# EAGLE schematic Board (EAGLE 8.0.2)
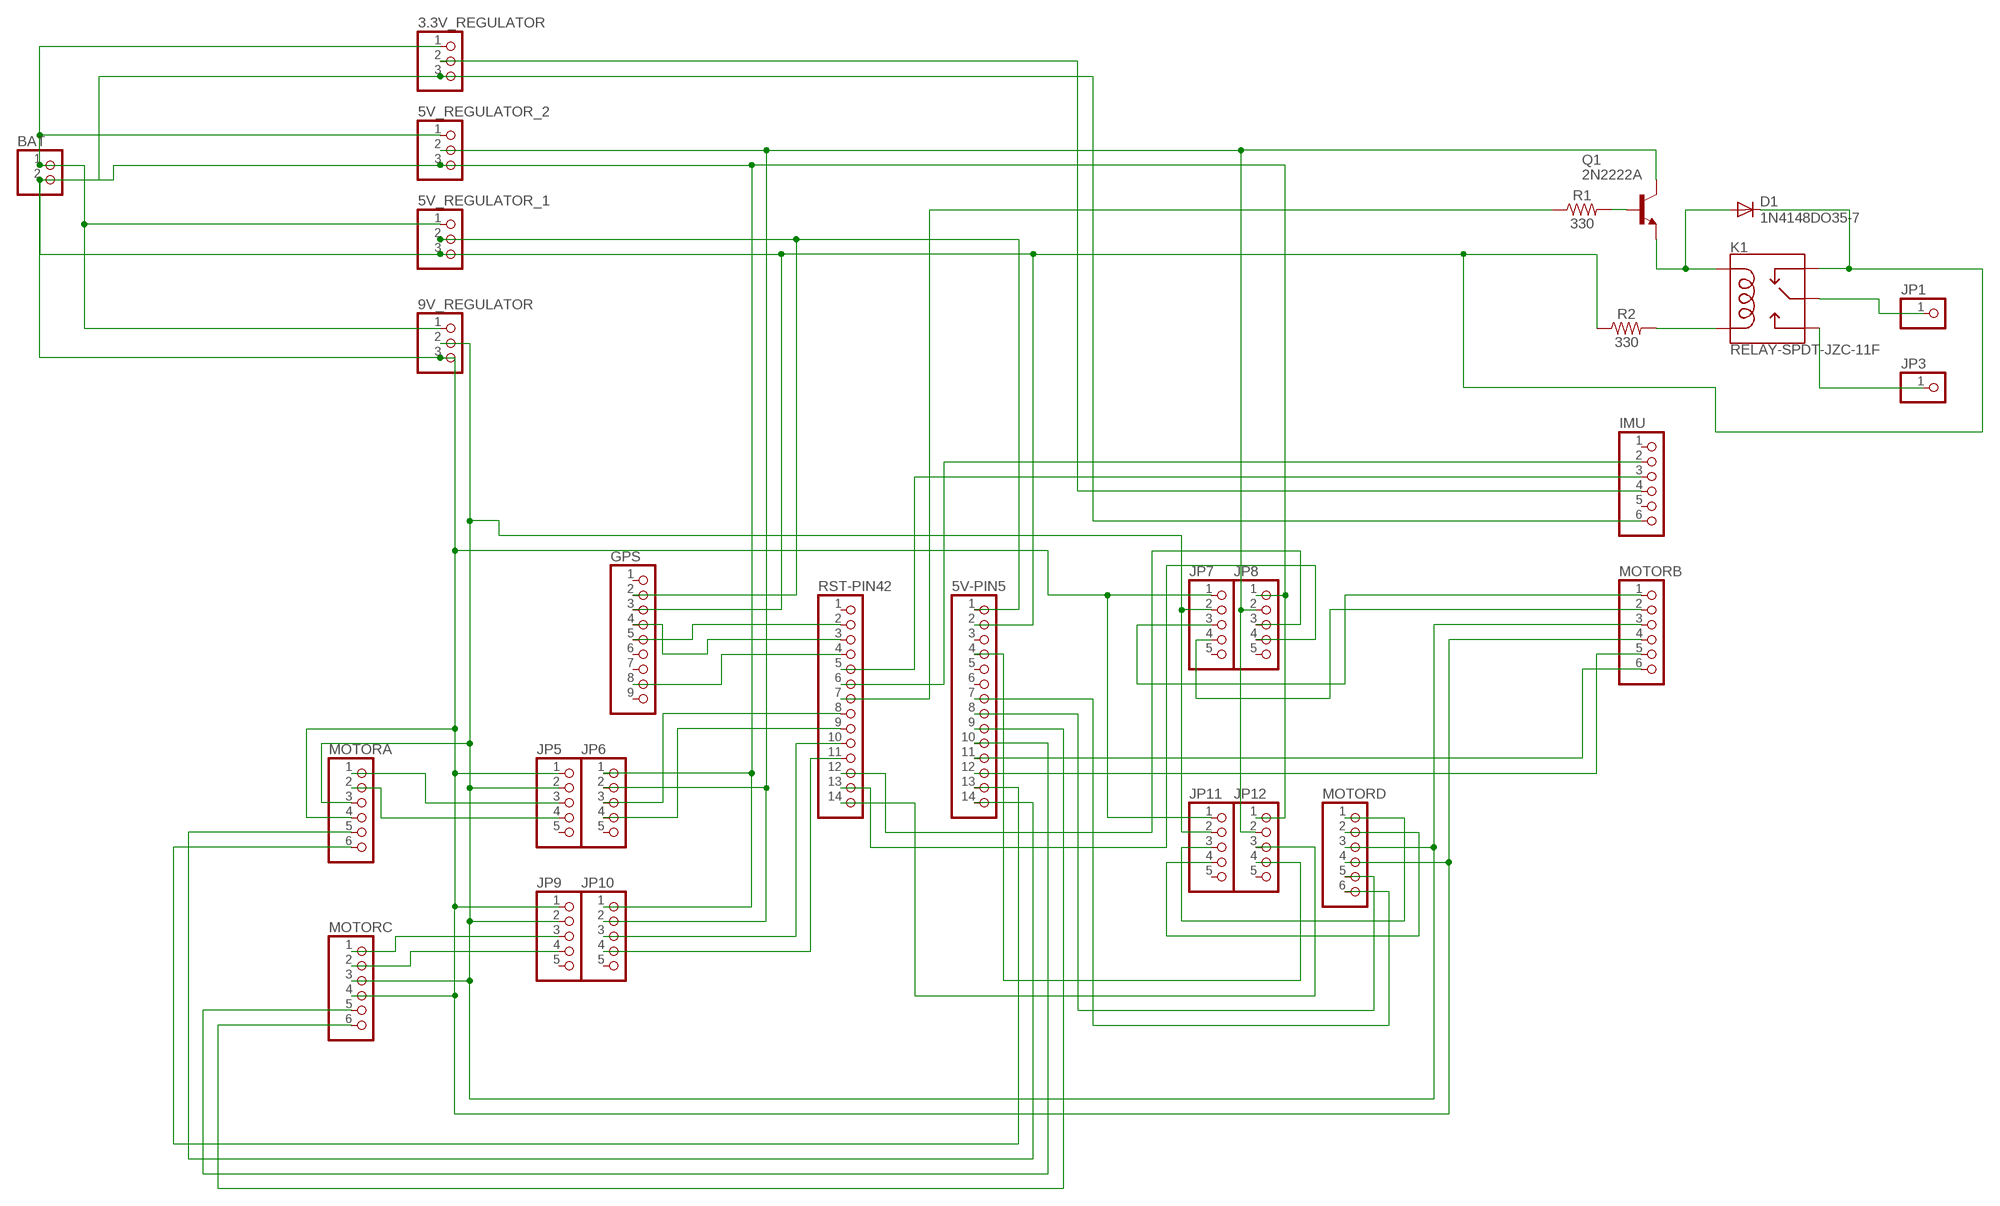
[diagram p0: schematic, sheet 1]

## Parts
3.3V_REGULATOR  PINHD-1X3  [1X03]
5V-PIN5  PINHD-1X14  [1X14]
5V_REGULATOR_1  PINHD-1X3  [1X03]
5V_REGULATOR_2  PINHD-1X3  [1X03]
9V_REGULATOR  PINHD-1X3  [1X03]
BAT  PINHD-1X2  [1X02]
D1  1N4148DO35-7  [DO35-7]
GPS  PINHD-1X9  [1X09]
IMU  PINHD-1X6  [1X06]
JP1  PINHD-1X1  [1X01]
JP3  PINHD-1X1  [1X01]
JP5  PINHD-1X5  [1X05]
JP6  PINHD-1X5  [1X05]
JP7  PINHD-1X5  [1X05]
JP8  PINHD-1X5  [1X05]
JP9  PINHD-1X5  [1X05]
JP10  PINHD-1X5  [1X05]
JP11  PINHD-1X5  [1X05]
JP12  PINHD-1X5  [1X05]
K1  RELAY-SPDT-JZC-11F  [RELAY-JZC]
MOTORA  PINHD-1X6  [1X06]
MOTORB  PINHD-1X6  [1X06]
MOTORC  PINHD-1X6  [1X06]
MOTORD  PINHD-1X6  [1X06]
Q1  2N2222A  [TO18]
R1  330  330OHM-0603-1/10W-1%  [0603]
R2  330  330OHM-0603-1/10W-1%  [0603]
RST-PIN42  PINHD-1X14  [1X14]

## Nets
N$1: GPS.5 RST-PIN42.2
N$2: GPS.4 RST-PIN42.3
N$3: Q1.2(B) R1.2
N$4: R1.1 RST-PIN42.7
N$5: GPS.8 RST-PIN42.4
N$6: IMU.3 RST-PIN42.5
N$7: IMU.2 RST-PIN42.6
N$8: JP6.3 RST-PIN42.8
N$9: JP6.4 RST-PIN42.9
N$10: 5V-PIN5.14 MOTORA.5
N$11: JP10.3 RST-PIN42.10
N$12: JP10.4 RST-PIN42.11
N$13: JP8.3 RST-PIN42.12
N$14: JP8.4 RST-PIN42.13
N$15: JP12.3 RST-PIN42.14
N$16: 5V-PIN5.4 JP12.4
N$17: JP5.3 MOTORA.1
N$18: 9V_REGULATOR.2 JP5.2 JP7.2 JP9.2 JP11.2 MOTORA.3 MOTORB.3 MOTORC.3 MOTORD.3
N$19: 5V-PIN5.10 MOTORC.5
N$20: JP9.4 MOTORC.2
N$21: 5V-PIN5.9 MOTORC.6
N$22: 5V-PIN5.12 MOTORB.5
N$23: 5V-PIN5.13 MOTORA.6
N$24: 5V-PIN5.11 MOTORB.6
N$25: 5V-PIN5.8 MOTORD.5
N$26: 5V-PIN5.7 MOTORD.6
N$28: JP11.3 MOTORD.1
N$29: JP11.4 MOTORD.2
N$30: JP5.4 MOTORA.2
N$31: K1.1(COIL2) R2.2
N$32: D1.A K1.5(COIL1) Q1.1(E)
N$33: 3.3V_REGULATOR.1 5V_REGULATOR_1.1 5V_REGULATOR_2.1 9V_REGULATOR.1 BAT.1
N$34: JP7.3 MOTORB.1
N$35: JP7.4 MOTORB.2
N$36: JP1.1 K1.4(MAIN)
N$37: 5V_REGULATOR_2.2 JP6.2 JP8.2 JP10.2 JP12.2 Q1.3(C)
N$38: JP3.1 K1.3(NO)
N$39: 5V-PIN5.1 5V_REGULATOR_1.2 GPS.2
N$40: JP9.3 MOTORC.1
N$41: 3.3V_REGULATOR.2 IMU.4
N$46: 3.3V_REGULATOR.3 5V-PIN5.2 5V_REGULATOR_1.3 5V_REGULATOR_2.3 9V_REGULATOR.3 BAT.2 D1.C GPS.3 IMU.6 JP5.1 JP6.1 JP7.1 JP8.1 JP9.1 JP10.1 JP11.1 JP12.1 K1.2(NC) MOTORA.4 MOTORB.4 MOTORC.4 MOTORD.4 R2.1
Unconnected: 5V-PIN5.3 5V-PIN5.5 5V-PIN5.6 GPS.1 GPS.6 GPS.7 GPS.9 IMU.1 IMU.5 JP5.5 JP6.5 JP7.5 JP8.5 JP9.5 JP10.5 JP11.5 JP12.5 RST-PIN42.1

## Library data of the parts
3.3V_REGULATOR 5V_REGULATOR_1 5V_REGULATOR_2 9V_REGULATOR = pinhead:PINHD-1X3: PIN HEADER
5V-PIN5 RST-PIN42 = pinhead:PINHD-1X14: PIN HEADER
BAT = pinhead:PINHD-1X2: PIN HEADER
D1 = diode:1N4148: DIODE high speed (Philips)
GPS = pinhead:PINHD-1X9: PIN HEADER
IMU MOTORA MOTORB MOTORC MOTORD = pinhead:PINHD-1X6: PIN HEADER
JP1 JP3 = pinhead:PINHD-1X1: PIN HEADER
JP5-JP12 = pinhead:PINHD-1X5: PIN HEADER
K1 = SparkFun-Electromechanical:RELAY-SPDT: SPDT Electromechanical Relay Single-pole, double-throw sealed relays. When current is applied to the coil, it throws a simple changeover switch, terminating the connection from the NC contact to ground and closing the NO contact. Use them to switch high voltage/high current devices. SparkFun Products JQX-15F: Relay SPDT Sealed - 20A <https://www.sparkfun.com/products/10924> (COM-10924) JZC-11F: Relay SPDT Sealed <https://www.sparkfun.com/products/100> (COM-00100); PROD_ID: COMP-09533; SF_SKU: COM-00100
Q1 = transistor-npn:2N2222*: NPN Transistor
R1 R2 = SparkFun-Resistors:330OHM: 330Ω resistor A resistor is a passive two-terminal electrical component that implements electrical resistance as a circuit element. Resistors act to reduce current flow, and, at the same time, act to lower voltage levels within circuits. - Wikipedia; PROD_ID: RES-00818